# EAGLE design MRCS-Showcase-Miniature-Signal-Adapter (EAGLE 7.7.0)
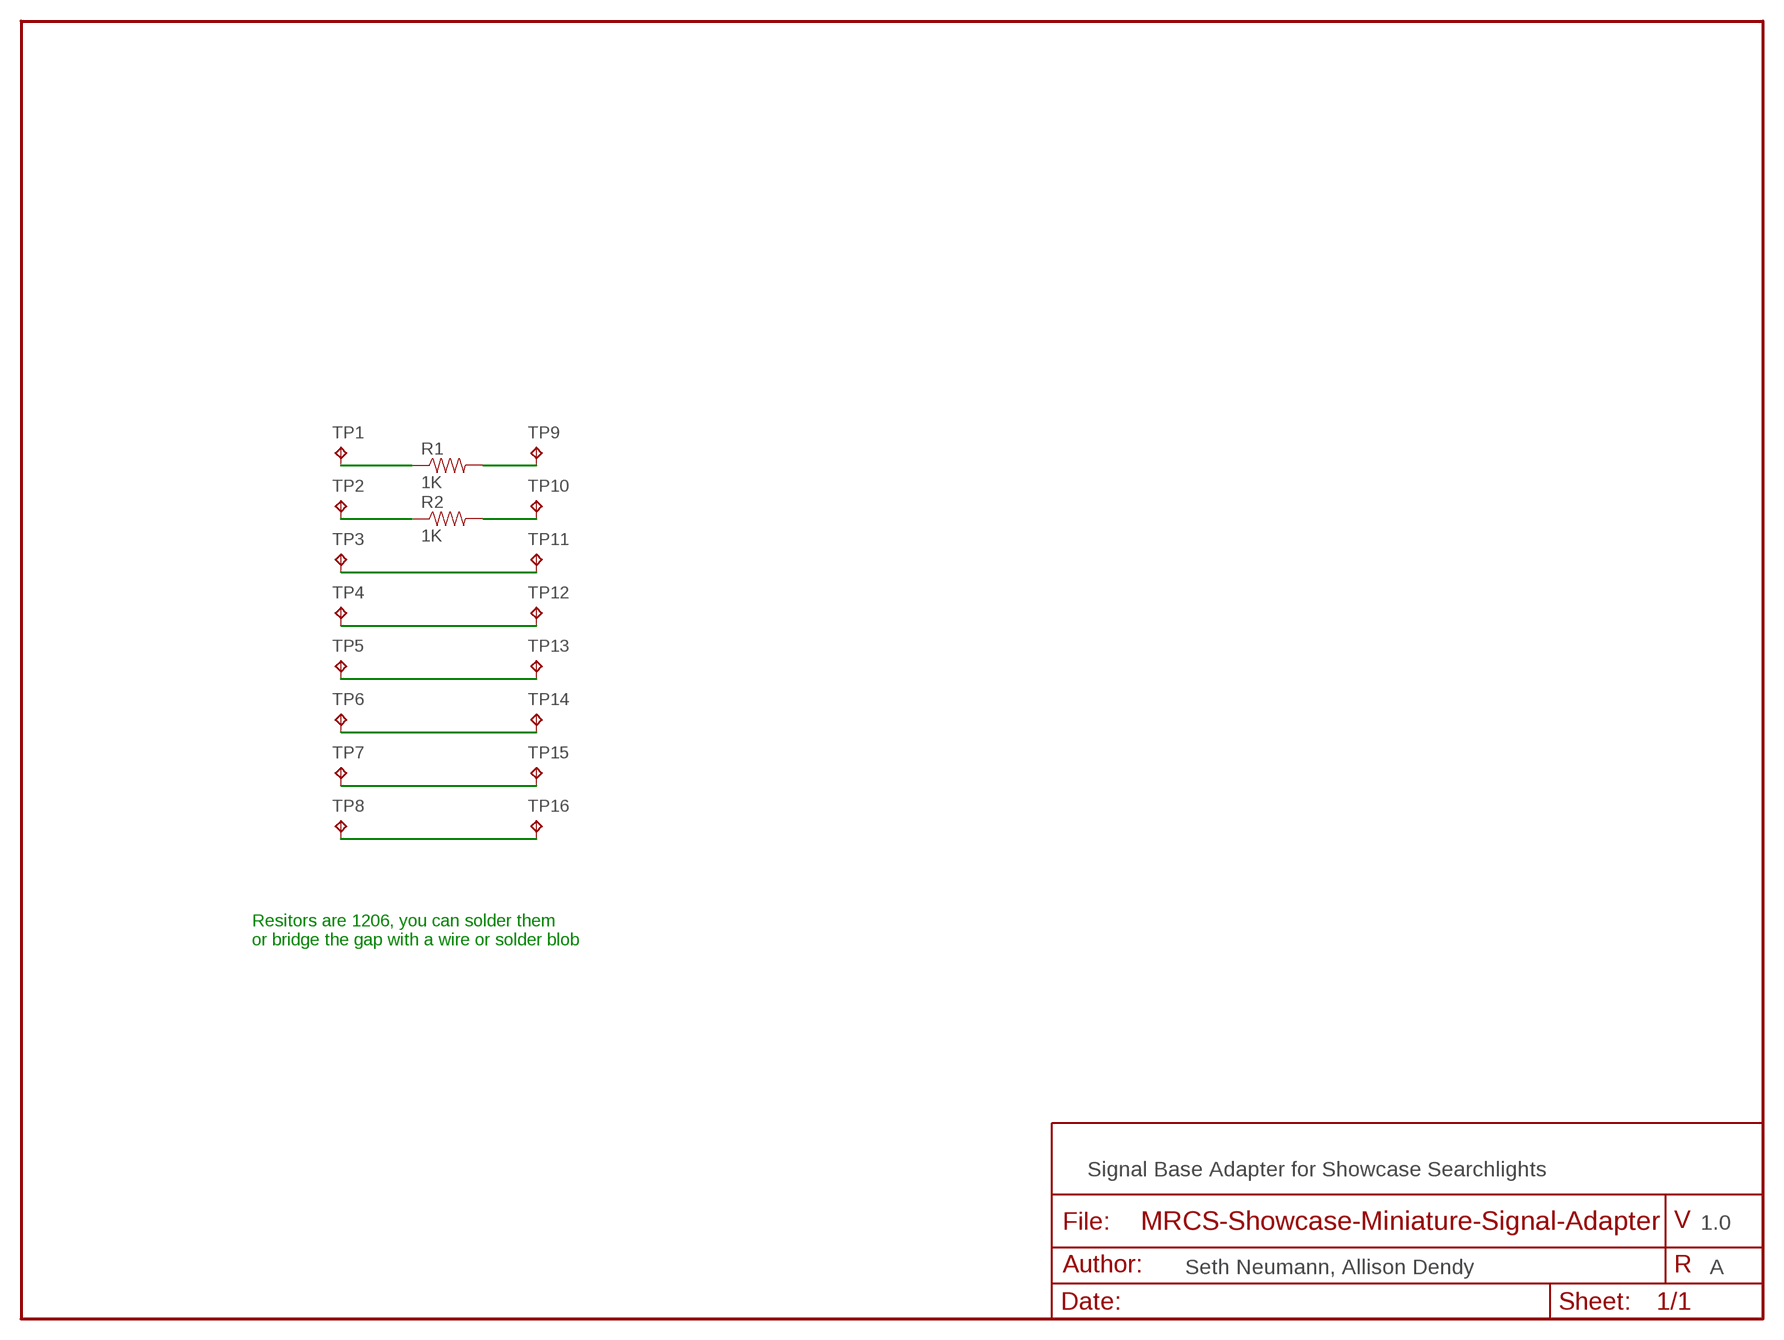
[diagram p0: schematic, sheet 1]

## Parts
R1  1K  R1206  [1206-RES]
R2  1K  R1206  [1206-RES]
TP1  TP  [P1-06]
TP2  TP  [P1-06]
TP3  TP  [P1-06]
TP4  TP  [P1-06]
TP5  TP  [P1-06]
TP6  TP  [P1-06]
TP7  TP  [P1-06]
TP8  TP  [P1-06]
TP9  TP  [P1-06]
TP10  TP  [P1-06]
TP11  TP  [P1-06]
TP12  TP  [P1-06]
TP13  TP  [P1-06]
TP14  TP  [P1-06]
TP15  TP  [P1-06]
TP16  TP  [P1-06]

## Nets
N$2: R1.1 TP1.P$1(TP)
N$3: R2.1 TP2.P$1(TP)
N$4: R2.2 TP10.P$1(TP)
N$5: TP3.P$1(TP) TP11.P$1(TP)
N$6: TP4.P$1(TP) TP12.P$1(TP)
N$7: TP5.P$1(TP) TP13.P$1(TP)
N$8: TP6.P$1(TP) TP14.P$1(TP)
N$9: TP7.P$1(TP) TP15.P$1(TP)
N$10: TP8.P$1(TP) TP16.P$1(TP)
N$17: R1.2 TP9.P$1(TP)

## Notes on the sheet
- Resitors are 1206, you can solder them
  or bridge the gap with a wire or solder blob
- Signal Base Adapter for Showcase Searchlights
- 1.0
- Seth Neumann, Allison Dendy | A

## Library data of the parts
R1 R2 = SPCoast:R*: Resistor Basic schematic elements and footprints for 0603, 1206, and PTH 1/10th watt (small) resistors.
TP1-TP16 = MRCS:TP: Test pad

## Board
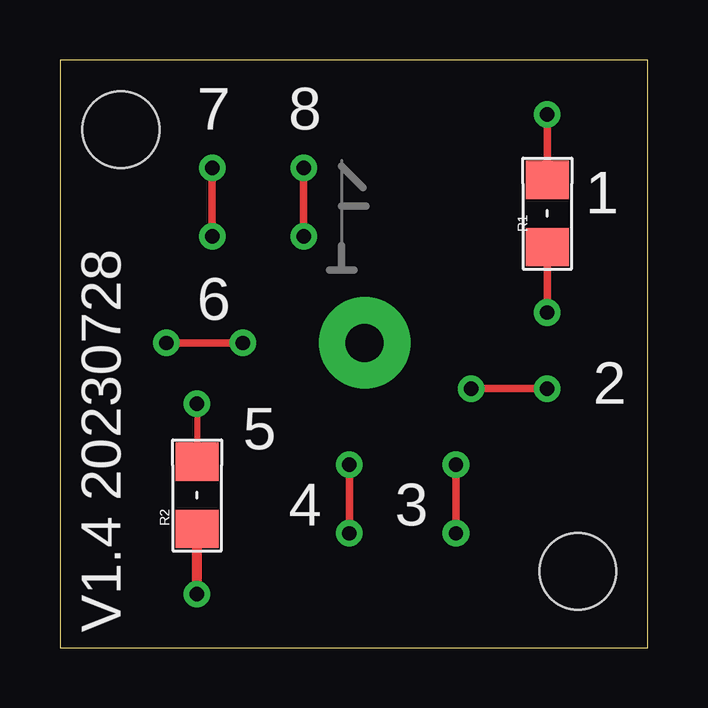
[diagram p1: board, top side]

Size 24.5 x 24.5 mm. Coordinates in mm from the lower left corner, seen from the top.
Outline: 0,0 24.5,0 24.5,24.5 0,24.5 0,0
Copper layers (1*16): Top 0.035mm / dielectric 1.5mm / Bottom 0.035mm
Design rules "default *": minimum track width 10mil, minimum drill 20mil, track to track 8mil, track to pad 8mil, pad to pad 8mil, via to via 8mil, smd to smd 8mil, copper to edge 40mil, drill to drill 8mil, minimum pad ring 10mil, minimum via ring 8mil, stop-mask expansion 4mil, vias tented up to drill 0mil, thermal gap 10mil
Holes 3.2 mm at 2.54,21.59 21.59,3.17

### Footprints (pad centres in the part's own frame; a part is rotated, then mirrored left to right if it is on the bottom)
1206-RES = smd 1.6 x 1.8: 1 -1.4,0; 2 1.4,0
P1-06 = drill 0.6: P$1 0,0

### Placement (x,y rotation side)
R1  20.32,18.1 90 top
R2  5.71,6.35 90 top
TP1  20.32,13.97 0 top
TP2  5.71,2.22 0 top
TP3  16.51,4.76 0 top
TP4  10.16,17.14 0 top
TP5  12.06,4.76 0 top
TP6  4.45,12.7 0 top
TP7  6.35,20 0 top
TP8  17.14,10.79 0 top
TP9  20.32,22.23 0 top
TP10  5.71,10.16 0 top
TP11  16.51,7.62 0 top
TP12  10.16,20 0 top
TP13  12.06,7.62 0 top
TP14  7.62,12.7 0 top
TP15  6.35,17.14 0 top
TP16  20.32,10.79 0 top
U$1  [MRCSLOGOTOP]  10.48,15.24 0 top

### Tracks (layer width: path | path; a pad name or v marks a point on that pad's centre or on a via)
N$1  (via drill 1.6 pad 3.81)
  other vias: 12.7,12.7
N$2
  Top 0.305: R1.1 TP1.P$1
N$3
  Top 0.406: TP2.P$1 R2.1
N$4
  Top 0.254: TP10.P$1 R2.2
N$5
  Top 0.305: TP11.P$1 TP3.P$1
N$6
  Top 0.305: TP12.P$1 TP4.P$1
N$7
  Top 0.305: TP13.P$1 TP5.P$1
N$8
  Top 0.305: TP6.P$1 TP14.P$1
N$9
  Top 0.305: TP7.P$1 TP15.P$1
N$10
  Top 0.305: TP8.P$1 TP16.P$1
N$17
  Top 0.305: TP9.P$1 R1.2

### Text on the board
tPlace: 7 | 8 | 1 | 6 | 2 | 5 | 4 | 3 | V1.4 20230728
_tNames: R1 | R2